# Altium schematic sheet Peripherals.SchDoc
size A4; CheckedBy: Sr. Andrés Roldán; Address1: Avda. Madrid 28, Edif. I+D Josefina Castro Vizoso,  2ª planta 18012 - GRANADA, SPAIN; SheetNumber: 4; SheetTotal: 6
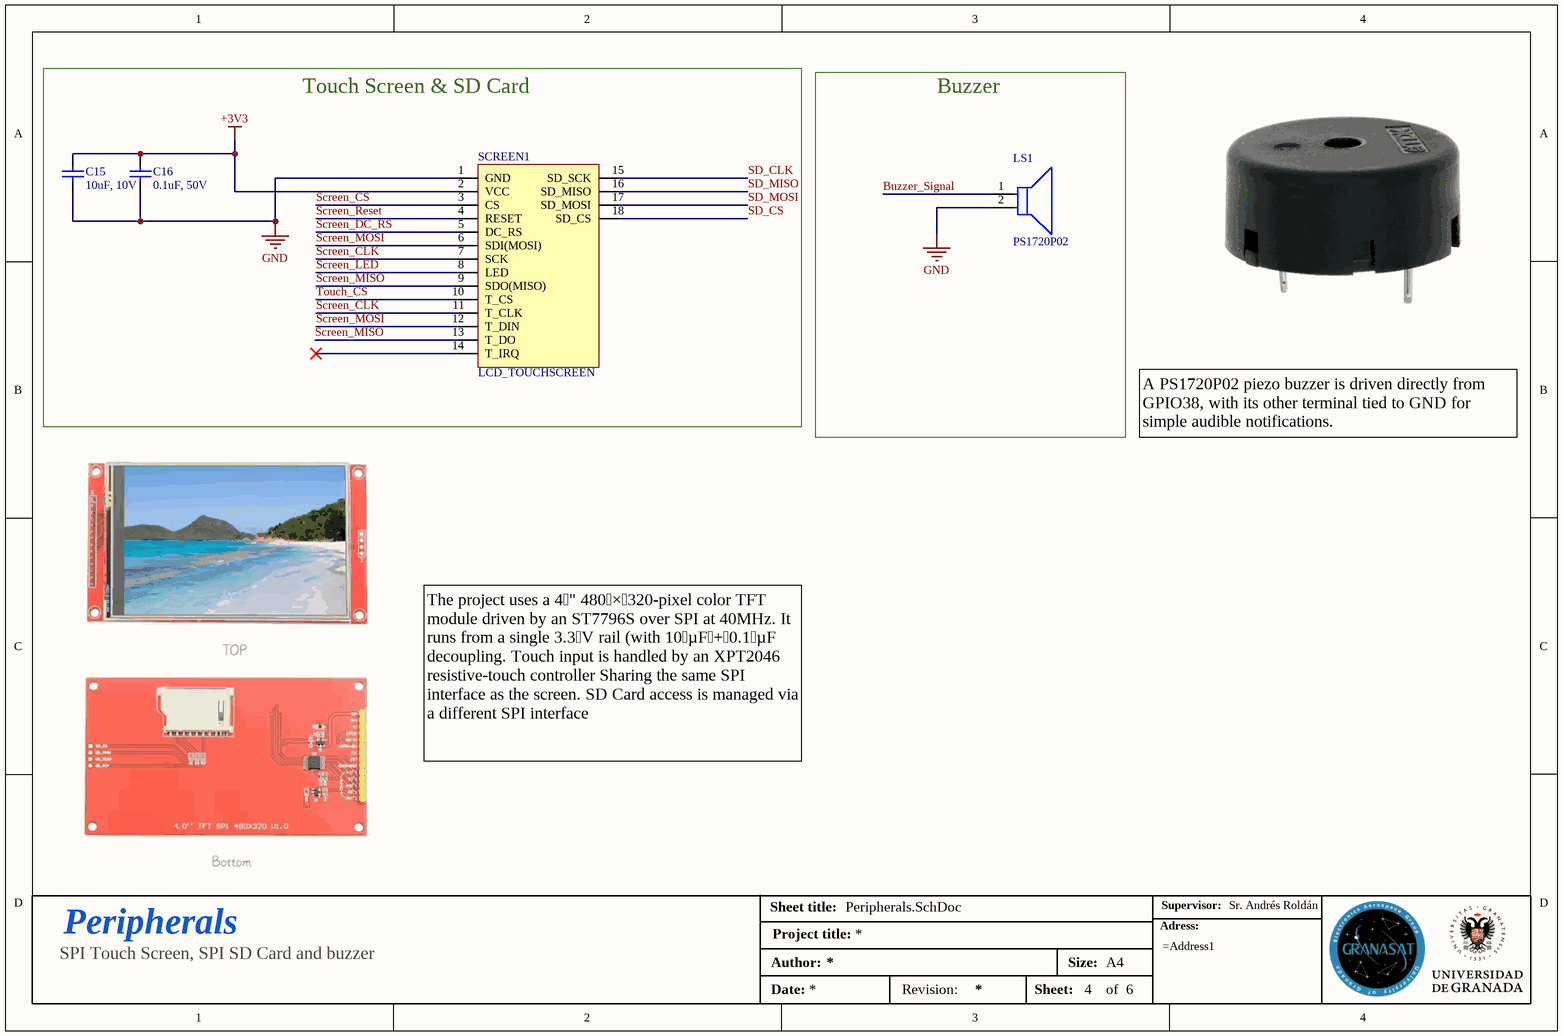
[diagram p0: Peripherals.SchDoc]

## Parts
C15  10uF, 10V  [CAP 0402_1005]
C16  0.1uF, 50V  [CAP 0402_1005]
LS1  PS1720P02  [FP-PS1720P02-MFG]
SCREEN1  LCD_TOUCHSCREEN  [LCD_TouchScreen]

## Blocks framed on the sheet
Touch Screen & SD Card: C15 C16 SCREEN1
Buzzer: LS1

## Nets
+3V3: C15.2 C16.2 SCREEN1.2(VCC)
GND: C15.1 C16.1 LS1.2 SCREEN1.1(GND)
Buzzer_Signal: LS1.1
Screen_CLK: SCREEN1.7(SCK) SCREEN1.11(T_CLK)
Screen_CS: SCREEN1.3(CS)
Screen_DC_RS: SCREEN1.5(DC_RS)
Screen_LED: SCREEN1.8(LED)
Screen_MISO: SCREEN1.9(SDO(MISO)) SCREEN1.13(T_DO)
Screen_MOSI: SCREEN1.6(SDI(MOSI)) SCREEN1.12(T_DIN)
Screen_Reset: SCREEN1.4(RESET)
SD_CLK: SCREEN1.15(SD_SCK)
SD_CS: SCREEN1.18(SD_CS)
SD_MISO: SCREEN1.16(SD_MISO)
SD_MOSI: SCREEN1.17(SD_MOSI)
Touch_CS: SCREEN1.10(T_CS)

Not connected (* = marked no-connect by the designer): SCREEN1 14(T_IRQ)*

## Notes on the sheet
- A PS1720P02 piezo buzzer is driven directly from GPIO38, with its other terminal tied to GND for simple audible notifications.
- The project uses a 4 " 480 × 320‑pixel color TFT module driven by an ST7796S over SPI at 40MHz. It runs from a single 3.3 V rail (with 10 µF + 0.1 µF decoupling. Touch input is handled by an XPT2046 resistive‑touch controller Sharing the same SPI interface as the screen. SD Card access is managed via a different SPI interface
- Sheet title:
- Supervisor:
- Peripherals
- Author:
- Project title:
- Size:
- A4
- Adress:
- SPI Touch Screen, SPI SD Card and buzzer
- Date:
- Revision:
- Sheet:
- of

## Library data of the parts
C15 = CL05A106MP8NUB8: CAP CER 10UF 10V X5R 0402; Manufacturer: Samsung Electro-Mechanics; Dielectric Material: Ceramic; Multilayer: Yes; Tolerance  (fill in as +-): 20%; Supplier: Digikey; Supplier Part Number: 1276-6830-1-ND; Manufacturer Part Number: CL05A106MP8NUB8; Category: Ceramic Capacitors; Stock: 145439; Pricing: 1=0,2, 10=0,12, 100=0,0808, 1000=0,0568 (USD); Mounting Technology: Surface Mount; Pins: 2; Package Shape: Rectangular; Case/Package: 0402; Terminal Finish: Nickel; Min Operating Temperature: -55°C; Max Operating Temperature: 85°C; JESD-609 Code: e3; Value: 10uF; Capacitor Type: Ceramic; Packaging: Tape and Reel; Tolerance (fill in as +-): 20%; Rated DC Voltage (URdc): 10V; Temperature Characteristics Code: X5R; Termination: Wraparound; Reach SVHC Compliant: Yes; RoHS Compliant: Yes; ComponentLink1URL: https://datasheet.ciiva.com:443/pdfs/VipMasterIC/IC/SEMS/SEMS-S-A0008521219/SEMS-S-A0008521325-1.pdf?src-supplier=IHS+Markit; ComponentLink1Description: https://datasheet.ciiva.com:443/pdfs/VipMasterIC/IC/SEMS/SEMS-S-A0008521219/SEMS-S-A0008521325-1.pdf?src-supplier=IHS+Markit; ComponentLink2URL: https://datasheet.octopart.com/CL05A106MP8NUB8-Samsung-Electro-Mechanics-datasheet-181551178.pdf?src-supplier=Farnell; ComponentLink2Description: https://datasheet.octopart.com/CL05A106MP8NUB8-Samsung-Electro-Mechanics-datasheet-181551178.pdf?src-supplier=Farnell; ComponentLink3URL: https://datasheet.octopart.com/CL05A106MP8NUB8-Samsung-Electro-Mechanics-datasheet-141346815.pdf?src-supplier=Samsung+SCT; ComponentLink3Description: https://datasheet.octopart.com/CL05A106MP8NUB8-Samsung-Electro-Mechanics-datasheet-141346815.pdf?src-supplier=Samsung+SCT; ComponentLink4URL: https://datasheet.octopart.com/CL05A106MP8NUB8-Samsung-Electro-Mechanics-datasheet-136460857.pdf?src-supplier=Future+Electronics; ComponentLink4Description: https://datasheet.octopart.com/CL05A106MP8NUB8-Samsung-Electro-Mechanics-datasheet-136460857.pdf?src-supplier=Future+Electronics; ComponentLink5URL: https://datasheet.octopart.com/CL05A106MP8NUB8-Samsung-Electro-Mechanics-datasheet-110326781.pdf?src-supplier=Future+Electronics; ComponentLink5Description: https://datasheet.octopart.com/CL05A106MP8NUB8-Samsung-Electro-Mechanics-datasheet-110326781.pdf?src-supplier=Future+Electronics; ComponentLink6URL: https://datasheet.octopart.com/CL05A106MP8NUB8-Samsung-Electro-Mechanics-datasheet-96443587.pdf?src-supplier=Future+Electronics; ComponentLink6Description: https://datasheet.octopart.com/CL05A106MP8NUB8-Samsung-Electro-Mechanics-datasheet-96443587.pdf?src-supplier=Future+Electronics; ComponentLink7URL: https://datasheet.octopart.com/CL05A106MP8NUB8-Samsung-Electro-Mechanics-datasheet-68297032.pdf?src-supplier=Future+Electronics; ComponentLink7Description: https://datasheet.octopart.com/CL05A106MP8NUB8-Samsung-Electro-Mechanics-datasheet-68297032.pdf?src-supplier=Future+Electronics; ComponentLink8URL: https://datasheet.octopart.com/CL05A106MP8NUB8-Samsung-Electro-Mechanics-datasheet-86032222.pdf?src-supplier=Future+Electronics; ComponentLink8Description: https://datasheet.octopart.com/CL05A106MP8NUB8-Samsung-Electro-Mechanics-datasheet-86032222.pdf?src-supplier=Future+Electronics; LCSC Part Number: C307415
C16 = CL05B104KB5NNNC: CAP CER 0.1UF 50V X7R 0402; Manufacturer: Samsung; Dielectric Material: Ceramic; Value: 100nF; Multilayer: Yes; Tolerance  (fill in as +-): 10%; Supplier: Avnet; Supplier Part Number: CL05B104KB5NNNC; Manufacturer Part Number: CL05B104KB5NNNC; RoHS: Yes; Category: Ceramic Capacitors; Pricing: 100000=0,00598, 120000=0,00595, 220000=0,00592, 500000=0,00589, 1000000=0,00586 (USD); Mounting Technology: Surface Mount; Pins: 2; Package Shape: Rectangular; Case/Package: 0402; Terminal Finish: Nickel; Min Operating Temperature: -55°C; Max Operating Temperature: 125°C; JESD-609 Code: e3; Capacitor Type: Ceramic; Packaging: Tape and Reel; Tolerance (fill in as +-): 10%; Rated DC Voltage (URdc): 50V; Temperature Characteristics Code: X7R; Termination: Wraparound; Reach SVHC Compliant: Yes; RoHS Compliant: Yes; ComponentLink1URL: https://datasheet.ciiva.com:443/pdfs/VipMasterIC/IC/SEMS/SEMS-S-A0008523115/SEMS-S-A0008523176-1.pdf?src-supplier=IHS+Markit; ComponentLink1Description: https://datasheet.ciiva.com:443/pdfs/VipMasterIC/IC/SEMS/SEMS-S-A0008523115/SEMS-S-A0008523176-1.pdf?src-supplier=IHS+Markit; ComponentLink2URL: https://datasheet.octopart.com/CL05B104KB5NNNC-Samsung-datasheet-97040617.pdf?src-supplier=Future+Electronics; ComponentLink2Description: https://datasheet.octopart.com/CL05B104KB5NNNC-Samsung-datasheet-97040617.pdf?src-supplier=Future+Electronics; ComponentLink3URL: https://datasheet.octopart.com/CL05B104KB5NNNC-Samsung-datasheet-8326407.pdf?src-supplier=TME; ComponentLink3Description: https://datasheet.octopart.com/CL05B104KB5NNNC-Samsung-datasheet-8326407.pdf?src-supplier=TME; LCSC Part Number: C960916
LS1 = PS1720P02: Data Line Filter, 1 Function(s); LCSC Part Number: C96061
SCREEN1 = LCD_TOUCHSCREEN: Data Line Filter, 1 Function(s); Manufacturer: TDK; Manufacturer Part Number: PS1720P02; Channels: 1; Supplier: Digikey; Supplier Part Number: 445-2527-ND; RoHS: Yes; Category: Buzzers; Stock: 1498; Pricing: 1=0,72, 10=0,587, 25=0,5404, 50=0,5082, 100=0,4777, 250=0,44032, 500=0,4141, 1500=0,37586, 6000=0,3365 (USD); Mounting Technology: Through Hole; Min Operating Temperature: -20°C; Max Operating Temperature: 70°C; Filter Type: DATA LINE FILTER; Packaging: Tape and Reel; Diameter: 17mm; Height: 8mm; Reach SVHC Compliant: Yes; RoHS Compliant: Yes; ComponentLink1URL: https://datasheet.ciiva.com:443/pdfs/VipMasterIC/IC/TDKC/TDKCS08938/TDKCS08938-1.pdf?src-supplier=IHS+Markit; ComponentLink1Description: https://datasheet.ciiva.com:443/pdfs/VipMasterIC/IC/TDKC/TDKCS08938/TDKCS08938-1.pdf?src-supplier=IHS+Markit; ComponentLink2URL: https://datasheet.ciiva.com/4625/ef532-ps-4625320.pdf?src-supplier=Mouser; ComponentLink2Description: https://datasheet.ciiva.com/4625/ef532-ps-4625320.pdf?src-supplier=Mouser; ComponentLink3URL: https://datasheet.ciiva.com/8113/ef532-ps-8113419.pdf?src-supplier=Avnet; ComponentLink3Description: https://datasheet.ciiva.com/8113/ef532-ps-8113419.pdf?src-supplier=Avnet; ComponentLink4URL: https://datasheet.ciiva.com/0/ef532-ps-122.pdf?src-supplier=Digikey; ComponentLink4Description: https://datasheet.ciiva.com/0/ef532-ps-122.pdf?src-supplier=Digikey; ComponentLink5URL: https://datasheet.ciiva.com/1/ef532-ps-1628.pdf?src-supplier=Digikey; ComponentLink5Description: https://datasheet.ciiva.com/1/ef532-ps-1628.pdf?src-supplier=Digikey; ComponentLink6URL: https://datasheet.ciiva.com/16225/ef532-ps-16225129.pdf?src-supplier=Onlinecomponents.com; ComponentLink6Description: https://datasheet.ciiva.com/16225/ef532-ps-16225129.pdf?src-supplier=Onlinecomponents.com; ComponentLink7URL: https://datasheet.ciiva.com/16477/ef532-ps-16477599.pdf?src-supplier=Future+Electronics; ComponentLink7Description: https://datasheet.ciiva.com/16477/ef532-ps-16477599.pdf?src-supplier=Future+Electronics